# EAGLE schematic 3x3Top (EAGLE 7.3.0)
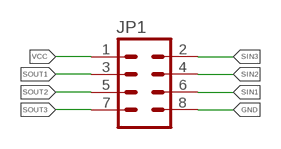
[diagram p0: schematic, sheet 1]

## Parts
JP1  M04X2  [2X4]

## Nets
GND: JP1.8
SIN1: JP1.6
SIN2: JP1.4
SIN3: JP1.2
SOUT1: JP1.3
SOUT2: JP1.5
SOUT3: JP1.7
VCC: JP1.1

## Library data of the parts
JP1 = SparkFun-Connectors:M04X2: .1" header, two rows of four.